# Altium project sound.PrjPCB
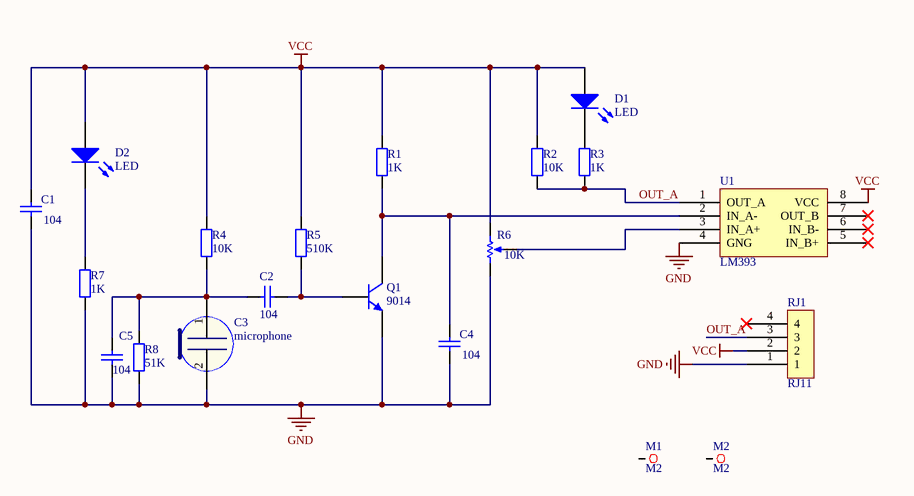
[diagram p0: sound.SchDoc]
1 sheet, 20 parts. Net scope: global (net labels, ports and power ports of the same name join across sheets).
Board file: sound.PcbDoc

## Sheet sound.SchDoc
size A4

### Parts
C1  value 104  [0603_C]  (hidden comment: Cap)
C2  value 104  [0603_C]  (hidden comment: Cap)
C3  microphone  [Microphone]
C4  value 104  [0603_C]  (hidden comment: Cap)
C5  value 104  [0603_C]  (hidden comment: Cap)
D1  LED  [0805]
D2  LED  [0805]
M1  M2  [M2]
M2  M2  [M2]
Q1  9014  [SOT23]
R1  value 1K  [0603_R]  (hidden comment: Res2)
R2  value 10K  [0603_R]  (hidden comment: Res2)
R3  value 1K  [0603_R]  (hidden comment: Res2)
R4  value 10K  [0603_R]  (hidden comment: Res2)
R5  value 510K  [0603_R]  (hidden comment: Res2)
R6  value 10K  [电位器]  (hidden comment: RPot)
R7  value 1K  [0603_R]  (hidden comment: Res2)
R8  value 51K  [0603_R]  (hidden comment: Res2)
RJ1  RJ11  [RJ11]
U1  LM393  [SO-8]

### Nets
GND: C1.1 C3.2 C4.1 C5.2 Q1.1(E) R6.1(TOP) R7.1 R8.1 RJ1.1 U1.4(GNG)
VCC: C1.2 D1.1(A) D2.1(A) R1.2 R2.2 R4.2 R5.2 R6.2(BOT) RJ1.2 U1.8(VCC)
OUT_A: R2.1 R3.1 RJ1.3 U1.1(OUT_A)
NetC2_1: C2.1 Q1.2(B) R5.1
NetC2_2: C2.2 C3.1 C5.1 R4.1 R8.2
NetC4_2: C4.2 Q1.3(C) R1.1 U1.2(IN_A-)
NetD1_2: D1.2(K) R3.2
NetD2_2: D2.2(K) R7.2
NetR6_3: R6.3(TAP) U1.3(IN_A+)

Not connected (* = marked no-connect by the designer): M1 0; M2 0; RJ1 4*; U1 5(IN_B+)* 6(IN_B-)* 7(OUT_B)*

### Library data of the parts
C1 C2 C4 C5 = Cap: Capacitor; Published: 8-Jun-2000; LatestRevisionDate: 17-Jul-2002; LatestRevisionNote: Re-released for DXP Platform.; PackageReference: RAD-0.3; Publisher: Altium Limited
D1 D2 = LED1: Typical RED GaAs LED; Published: 8-Jun-2000; LatestRevisionDate: 08-Jul-2005; LatestRevisionNote: Mech Layer 1 removed.; PackageReference: LED-1; Publisher: Altium Limited
M1 M2 = M3
Q1 = 2N3904: NPN General Purpose Amplifier; Published: 8-Jun-2000; LatestRevisionDate: 15-Jan-2003; LatestRevisionNote: PCB Footprint 'BCY-W3/D4.7' replaced; DatasheetVersion: 1997; PackageVersion: Sep-1998; PackageReference: TO-92A; Publisher: Altium Limited; Code_JEDEC: TO-92A; ComponentLink1Description: Manufacturer Link; ComponentLink1URL: http://www.fairchildsemi.com/; ComponentLink2Description: Datasheet; ComponentLink2URL: http://www.fairchildsemi.com/ds/2N%2F2N3904.pdf
R1-R5 R7 R8 = Res2: Resistor; Published: 8-Jun-2000; LatestRevisionDate: 17-Jul-2002; LatestRevisionNote: Re-released for DXP Platform.; PackageReference: AXIAL-0.4; Publisher: Altium Limited
R6 = RPot: Potentiometer; Sim Note: Enter the Resistance value and the set point into parameter fields.; Set Position: 0.5; Published: 8-Jun-2000; LatestRevisionDate: 17-Jul-2002; LatestRevisionNote: Re-released for DXP Platform.; PackageReference: VR5; Publisher: Altium Limited